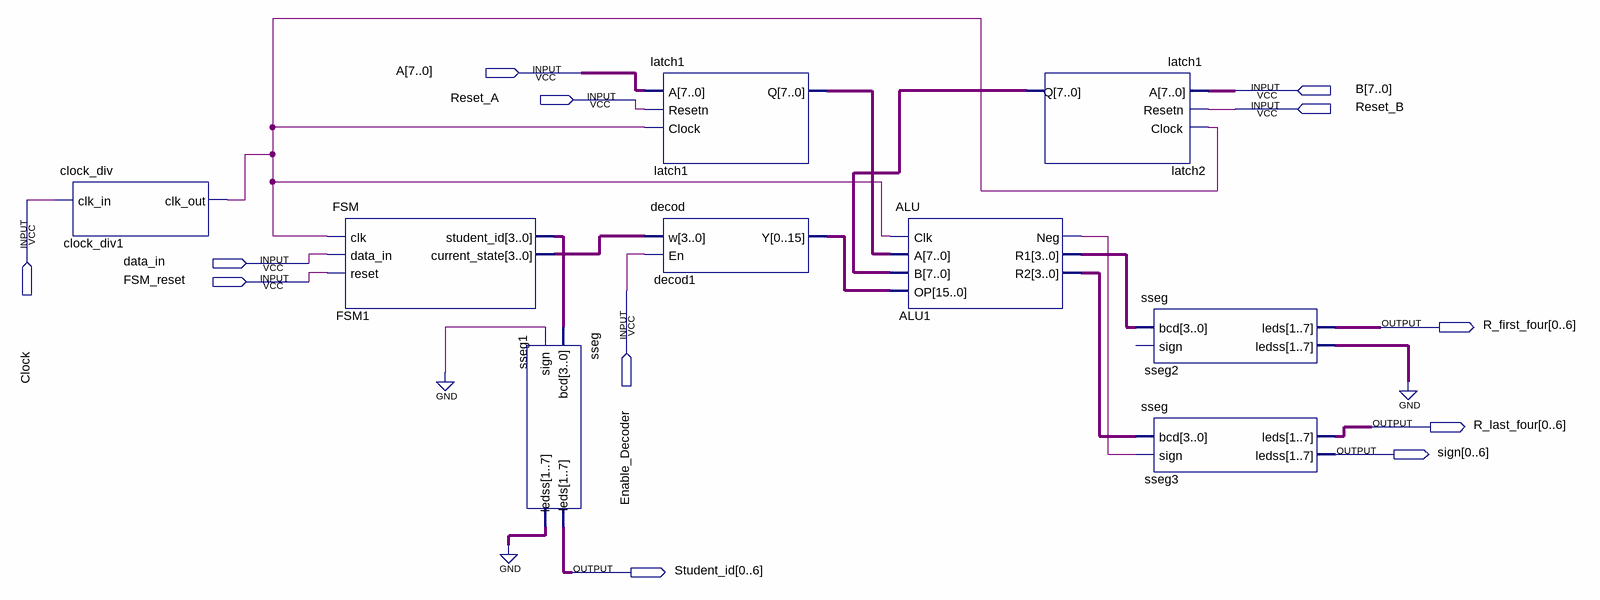
[diagram p0: schematic sheet]
// Quartus schematic Problem1Block.bdf as structural Verilog: 9 symbols, 12 pins
module Problem1Block (
  input  [7:0] A,
  input  [7:0] B,
  input  Reset_A,
  input  Reset_B,
  input  Clock,
  input  data_in,
  input  FSM_reset,
  input  Enable_Decoder,
  output [0:6] R_first_four,
  output [0:6] R_last_four,
  output [0:6] sign,
  output [0:6] Student_id
);

  wire ALU1_neg, clock_div1_clk_out;
  wire [3:0] ALU1_r1, ALU1_r2, FSM1_current_state, FSM1_student_id;
  wire [6:0] sseg1_ledss, sseg2_ledss;
  wire [7:0] latch1_q, latch2_q;
  wire [15:0] decod1_y;

  clock_div clock_div1 (.clk_in(Clock), .clk_out(clock_div1_clk_out));
  FSM FSM1 (
    .clk(clock_div1_clk_out), .data_in(data_in), .reset(FSM_reset), .student_id(FSM1_student_id),
    .current_state(FSM1_current_state));
  sseg sseg1 (.bcd(FSM1_student_id), .sign(1'b0), .leds(Student_id), .ledss(sseg1_ledss));
  latch1 latch1 (.A(A), .Resetn(Reset_A), .Clock(clock_div1_clk_out), .Q(latch1_q));
  decod decod1 (.w(FSM1_current_state), .En(Enable_Decoder), .Y(decod1_y));
  ALU ALU1 (
    .Clk(clock_div1_clk_out), .A(latch1_q), .B(latch2_q), .OP(decod1_y), .Neg(ALU1_neg), .R1(ALU1_r1),
    .R2(ALU1_r2));
  latch1 latch2 (.A(B), .Resetn(Reset_B), .Clock(clock_div1_clk_out), .Q(latch2_q));
  sseg sseg2 (.bcd(ALU1_r1), .leds(R_first_four), .ledss(sseg2_ledss));  // open: sign
  sseg sseg3 (.bcd(ALU1_r2), .sign(ALU1_neg), .leds(R_last_four), .ledss(sign));
  // also tied to GND on the sheet: {sseg1_ledss[0], sseg1_ledss[1], sseg1_ledss[2], sseg1_ledss[3], sseg1_ledss[4], sseg1_ledss[5], sseg1_ledss[6], sseg2_ledss[0], sseg2_ledss[1], sseg2_ledss[2], sseg2_ledss[3], sseg2_ledss[4], sseg2_ledss[5], sseg2_ledss[6]}
endmodule
